# EAGLE design Switched Outlet Rev C (EAGLE 9.7.0)
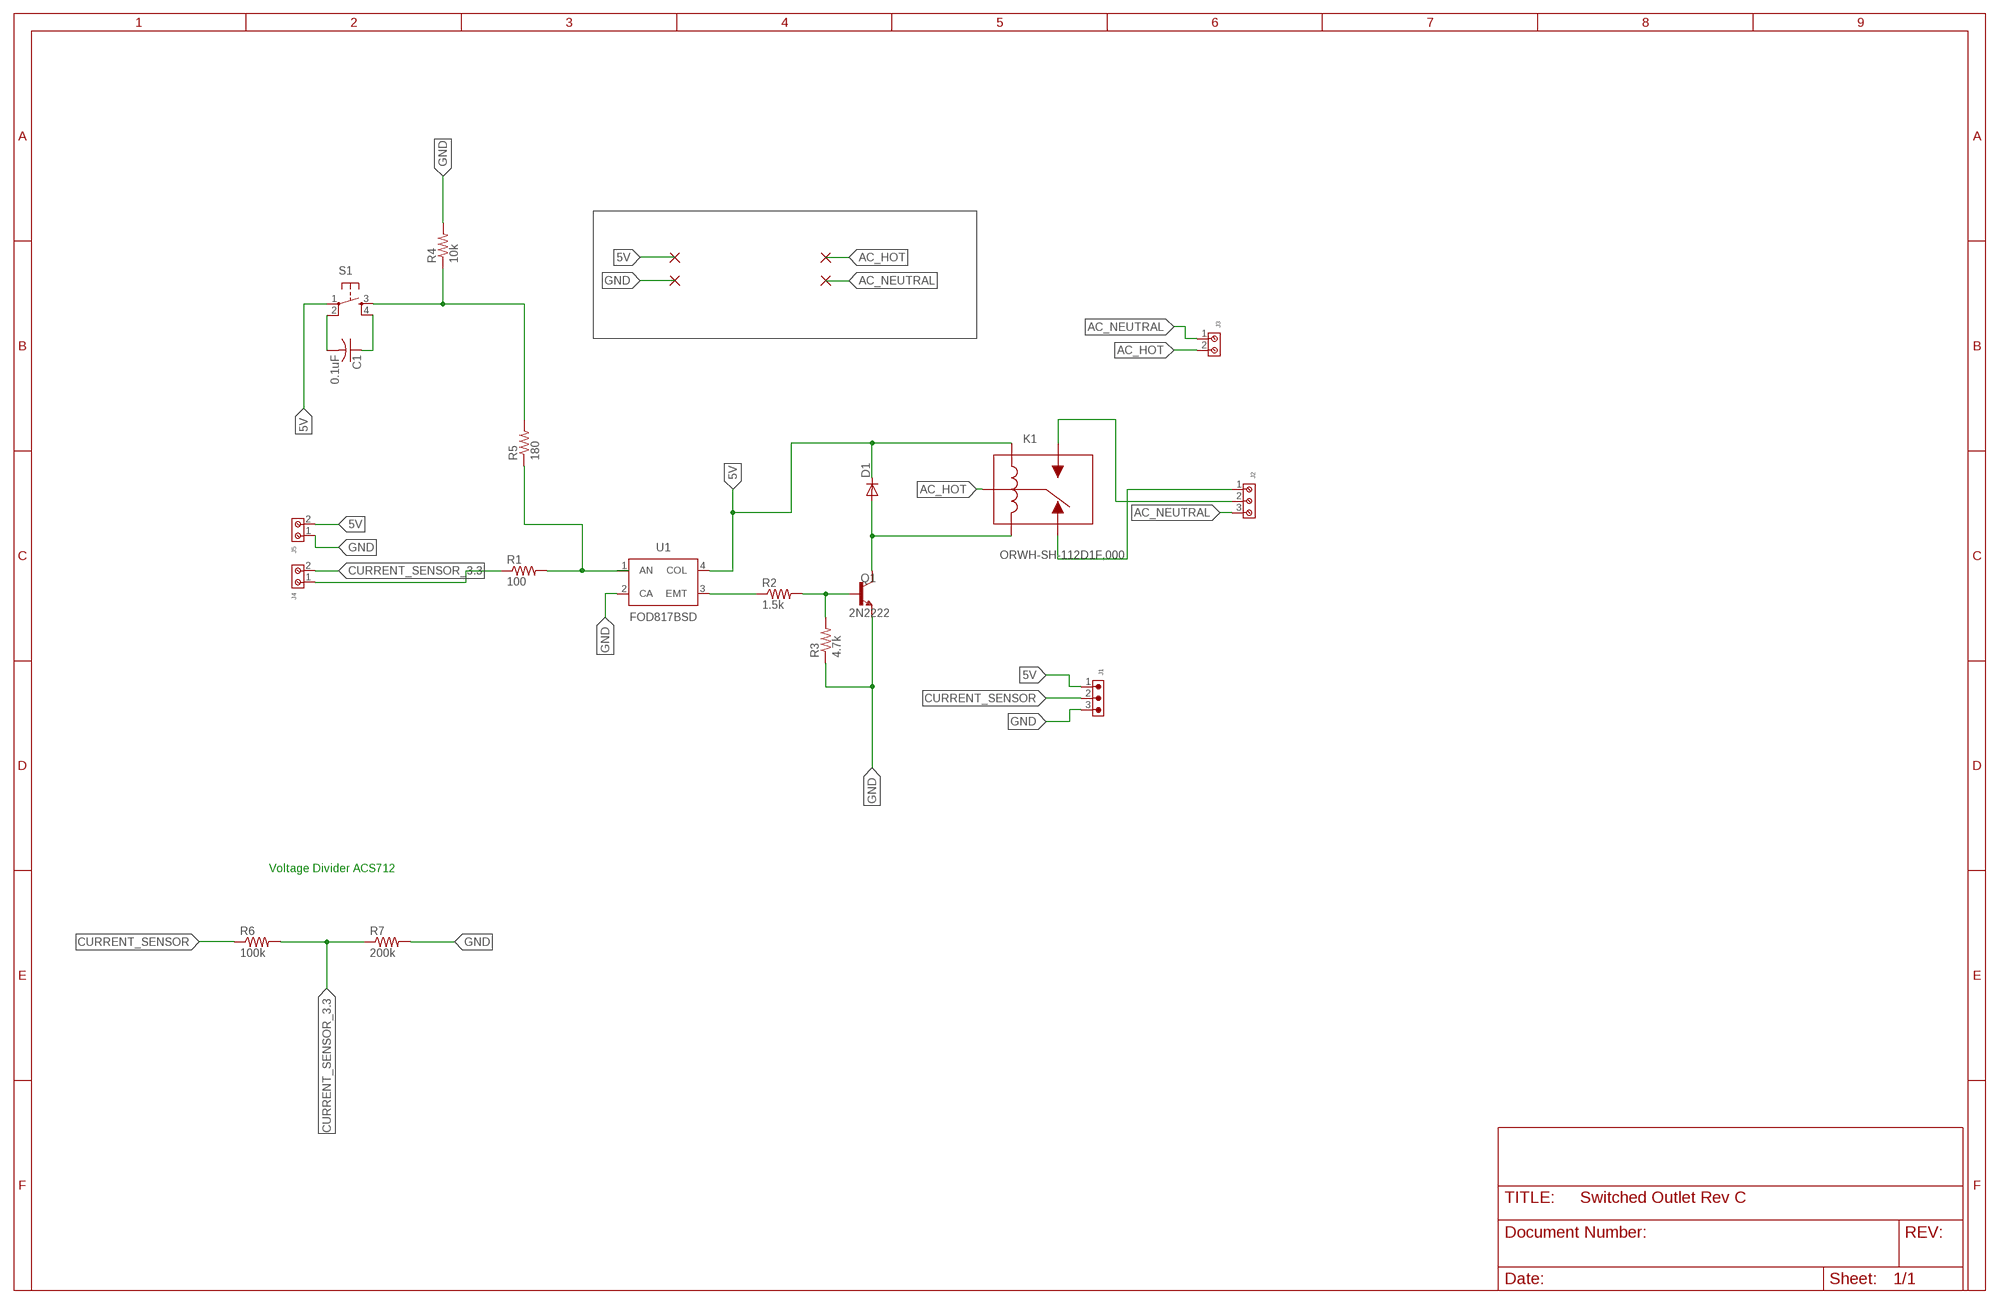
[diagram p0: schematic, sheet 1]

## Parts
C1  0.1uF  CAPACITOR-CERAMIC  [C050-024X044]
D1  1N4000  [DO41-10]
J1  6130XX11121_61300311121  [61300311121]
J2  691102710003  [691102710003]
J3  691102710002  [691102710002]
J4  691103110002  [691103110002]
J5  691103110002  [691103110002]
K1  ORWH-SH-112D1F,000  [ORWH-SH-112D1F,000]
Q1  2N2222  [TO92-EBC-OVAL]
R1  100  RESISTOR  [0207/10]
R2  1.5k  RESISTOR  [0207/10]
R3  4.7k  RESISTOR  [0207/10]
R4  10k  RESISTOR  [0207/10]
R5  180  RESISTOR  [0207/10]
R6  100k  RESISTOR  [0207/10]
R7  200k  RESISTOR  [0207/10]
S1  TACTILE-BUTTON10XX  [B3F-10XX]
U1  FOD817BSD  FOD817BSDSMT  [DIP1016W60P279L460H460Q4B]

## Nets
5V: D1.C J1.1 J5.2 K1.1 S1.1(P) U1.4(COL)
AC_HOT: J3.2 K1.2
AC_NEUTRAL: J2.3 J3.1
CURRENT_SENSOR: J1.2 R6.1
CURRENT_SENSOR_3.3: J4.2 R6.2 R7.1
GND: J1.3 J5.1 Q1.E R3.1 R4.2 R7.2 U1.2(CA)
N$1: J4.1 R1.1
N$2: R1.2 R5.1 U1.1(AN)
N$3: R2.1 U1.3(EMT)
N$4: Q1.B R2.2 R3.2
N$5: D1.A K1.3 Q1.C
N$6: J2.1 K1.4
N$7: J2.2 K1.5
N$8: R4.1 R5.2 S1.3(S)
N$9: C1.2 S1.2(P1)
N$10: C1.1 S1.4(S1)

## Notes on the sheet
- Voltage Divider ACS712

## Library data of the parts
C1 = Quantum Projects:CAPACITOR-CERAMIC
D1 = Quantum Projects:1N4000
J1 = Wurth_Connectors_WR-PHD:6130XX11121_61300311121: WR-PHD 2.54 mm THT Pin Header ARTICLE PROPERTIES: Pins:1;​ 2;​ 3;​ 4;​ 5;​ 6;​ 7;​ 8;​ 9;​ 10;​ 12;​ 13;​ 14;​ 15;​ 16;​ 18;​ 20;​ 22;​ 24;​ 25;​ 32;​ 36;​ 40 KIND PROPERTIES: Pitch：2.54 mm Quality Class:3 as per CECC 75 301-802 Rows：Single Gender：Pin Header Type：Straight MATERIAL PROPERTIES: Insulator Material :PBT Insulator Flammability Rating:UL94 V-0 Contact Material:Copper Alloy Contact Plating:Gold Contact Type:Stamped GENERAL INFORMATION Operating Temperature:-40 up to +105 °C Compliance:RoHS ELECTRICAL PROPERTIES: Rated Current:3 A IR 1:3 A Withstanding Voltage:500 V (AC) Contact Resistance:20 mΩ RISO:1000 MΩ CERTIFICATION UL Approval:E323964 PACKAGING PROPERTIES Packaging:Bag <https://katalog.we-online.com/media/images/v2/o33211v209%20Family_BTB_PHD_6130xx11121.jpg> Details see: https://katalog.we-online.com/en/em/PHD_2_54_THT_PIN_HEADER_6130XX11121 Updated by Yingchun,Shan 2019-10-16 2019 (C) Würth Elektronik; DATASHEET-URL: https://katalog.we-online.com/em/datasheet/61300311121.pdf; GENDER: Pin Header; IR: 3A; MATES: WR-PHD 2.54mm Angled Socket Header /SMT Socket Header/Socket Header; PACKAGING: Bag; PART-NUMBER: 61300311121; PINS: 3; ROWS: Single; TYPE: Straight
J2 = Wurth_Connectors_WR-TBL Wire Protector:691102710003: WR-TBL Serie 102 - 5.00 mm Horiz. Entry Modular KIND PROPERTIES Pitch 5 mm MATERIAL PROPERTIES Insulator Material PA66 Insulator Flammability Rating UL94 V-0 Insulator Color Blue Contact Material Brass Contact Plating Copper over Zinc Terminal Screw Material Steel Terminal Screw Plating Zinc Wire Guard Material Stainless Steel GENERAL INFORMATION Operating Temperature -40 up to +105 °C Compliance Lead free / RoHS ELECTRICAL PROPERTIES IR cULus 15 A IR VDE 17.5 A Working Voltage [cULus] 300 V (AC) Working Voltage [VDE] 250 V (AC) Withstanding Voltage [UL] 1600 V (AC) Withstanding Voltage [cULus] 1600 V (AC) Withstanding Voltage [VDE] 2000 V (AC) Contact Resistance [UL] 20 mΩ Contact Resistance [cULus] 20 mΩ Contact Resistance [VDE] 20 mΩ MECHANICAL PROPERTIES Wire Strip Length 5 up to 6 (mm) Screw M2.6 Solid Wire Section (AWG) 22 to 14 (AWG) Solid Wire Section (Metric) 0.326 to 2.08 (mm²) Stranded Wire Section (AWG) 22 to 14 (AWG) Stranded Wire Section (Metric) 0.326 to 2.08 (mm²) CERTIFICATION cULus Approval E315414 UL Approval E315414 VDE Approval 40022612 VDE Approval 40022612 Model number 102 PACKAGING PROPERTIES Packaging Box <https://katalog.we-online.com/media/images/v2/o33225v209%20Family_WR-TBL_69110271000x.jpg> Details see: https://katalog.we-online.com/en/em/TBL_5_00_102_6911027100XX Updated by Ella Wu 2019-11-07 2019(C) Wurth Elektronik; DATASHEET-URL: https://www.we-online.com/catalog/datasheet/691102710003.pdf; IR-UL: 15A; IR-VDE: 17.5A; MOUNT: THT; PART-NUMBER: 691102710003; PINS: 3; PITCH: 5mm; TYPE: Horizontal; WIRE: 22 to 14 (AWG) 0.326 to 2.08 (mm²); WORKING-VOLTAGE-UL: 300V(AC); WORKING-VOLTAGE-VDE: 250V(AC)
J3 = Wurth_Connectors_WR-TBL Wire Protector:691102710002: WR-TBL Serie 102 - 5.00 mm Horiz. Entry Modular KIND PROPERTIES Pitch 5 mm MATERIAL PROPERTIES Insulator Material PA66 Insulator Flammability Rating UL94 V-0 Insulator Color Blue Contact Material Brass Contact Plating Copper over Zinc Terminal Screw Material Steel Terminal Screw Plating Zinc Wire Guard Material Stainless Steel GENERAL INFORMATION Operating Temperature -40 up to +105 °C Compliance Lead free / RoHS ELECTRICAL PROPERTIES IR cULus 15 A IR VDE 17.5 A Working Voltage [cULus] 300 V (AC) Working Voltage [VDE] 250 V (AC) Withstanding Voltage [UL] 1600 V (AC) Withstanding Voltage [cULus] 1600 V (AC) Withstanding Voltage [VDE] 2000 V (AC) Contact Resistance [UL] 20 mΩ Contact Resistance [cULus] 20 mΩ Contact Resistance [VDE] 20 mΩ MECHANICAL PROPERTIES Wire Strip Length 5 up to 6 (mm) Screw M2.6 Solid Wire Section (AWG) 22 to 14 (AWG) Solid Wire Section (Metric) 0.326 to 2.08 (mm²) Stranded Wire Section (AWG) 22 to 14 (AWG) Stranded Wire Section (Metric) 0.326 to 2.08 (mm²) CERTIFICATION cULus Approval E315414 UL Approval E315414 VDE Approval 40022612 VDE Approval 40022612 Model number 102 PACKAGING PROPERTIES Packaging Box <https://katalog.we-online.com/media/images/v2/o33225v209%20Family_WR-TBL_69110271000x.jpg> Details see: https://katalog.we-online.com/en/em/TBL_5_00_102_6911027100XX Updated by Ella Wu 2019-11-07 2019(C) Wurth Elektronik; DATASHEET-URL: https://www.we-online.com/catalog/datasheet/691102710002.pdf; IR-UL: 15A; IR-VDE: 17.5A; MOUNT: THT; PART-NUMBER: 691102710002; PINS: 2; PITCH: 5mm; TYPE: Horizontal; WIRE: 22 to 14 (AWG) 0.326 to 2.08 (mm²); WORKING-VOLTAGE-UL: 300V(AC); WORKING-VOLTAGE-VDE: 250V(AC)
J4 J5 = Wurth_Connectors_WR-TBL Wire Protector:691103110002: WR-TBL Serie 1031 - 3.50 mm Horiz. Entry Modular KIND PROPERTIES Pitch 3.5 mm MATERIAL PROPERTIES Insulator Material PA66 Insulator Flammability Rating UL94 V-0 Insulator Color Blue Contact Material Brass Contact Plating Copper over Zinc Terminal Screw Material Steel Terminal Screw Plating Zinc Wire Guard Material Stainless Steel GENERAL INFORMATION Operating Temperature -40 up to +105 °C Compliance Lead free / RoHS ELECTRICAL PROPERTIES IR UL 10 A Working Voltage [UL] 125 V (AC) Withstanding Voltage [UL] 1250 V (AC) Contact Resistance 20 mΩ Contact Resistance [UL] 20 mΩ MECHANICAL PROPERTIES Wire Strip Length 5 up to 6 (mm) Screw M2 Solid Wire Section (AWG) 26 to 16 (AWG) Solid Wire Section (Metric) 0.129 to 1.31 (mm²) Stranded Wire Section (AWG) 26 to 16 (AWG) Stranded Wire Section (Metric) 0.129 to 1.31 (mm²) CERTIFICATION UL Approval E315414 PACKAGING PROPERTIES Packaging Box <https://katalog.we-online.com/media/images/v2/o33226v209%20Family_WR-TBL_69110311000x.jpg> Details see: https://katalog.we-online.com/en/em/TBL_3_50_1031_6911031100XX Updated by Ella Wu 2019-11-07 2019(C) Wurth Elektronik; DATASHEET-URL: https://www.we-online.com/catalog/datasheet/691103110002.pdf; IR-UL: 10A; MOUNT: THT; PART-NUMBER: 691103110002; PINS: 2; PITCH: 3.5mm; TYPE: Horizontal; WIRE: 26 to 16 (AWG) 0.129 to 1.31 (mm²); WORKING-VOLTAGE-UL: 125V(AC)
K1 = Relay:ORWH-SH-112D1F,000: RELAY GEN PURPOSE SPDT 10A 12V Manufacturer's datasheet <https://www.te.com/commerce/DocumentDelivery/DDEController?Action=srchrtrv&DocNm=1721150&DocType=Customer+Drawing&DocLang=English>; CREATED_BY: PCBLayout.com; DIGIKEY_PART_NUMBER: PB2029-ND; MANUFACTURER: TE Connectivity Potter & Brumfield Relays; MANUFACTURER_PART_NUMBER: ORWH-SH-112D1F,000
Q1 = Quantum Projects:2N2222
R1-R7 = Quantum Projects:RESISTOR
S1 = Quantum Projects:TACTILE-BUTTON
U1 = Opto-Electronic:FOD817BSD: 4-Pin DIP Phototransistor Optocouplers; CATEGORY: Opto-Electronic; MANUFACTURER: ON Semiconductor; MPN: FOD817BSD; OPERATING_TEMP: -55 to +110 °C; PART_STATUS: Active; ROHS_COMPLIANT: RoHS3 Compliant; SUB-CATEGORY: OptoCoupler; THERMALLOSS: 0.2W

## Board
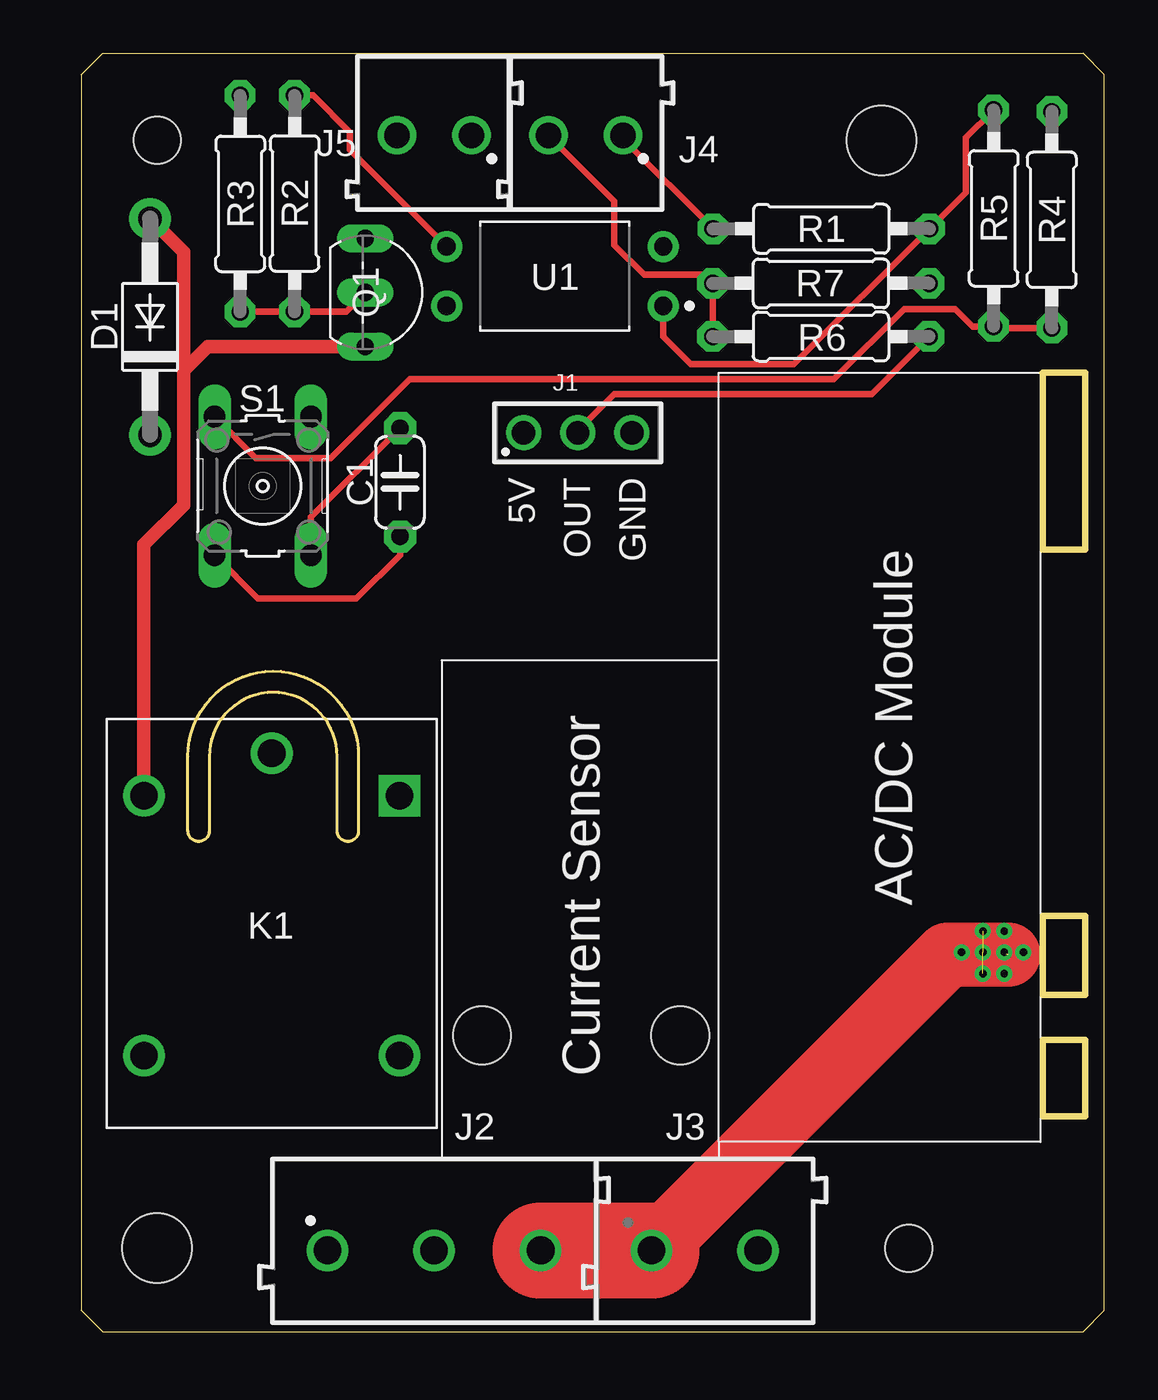
[diagram p1: board, top side]
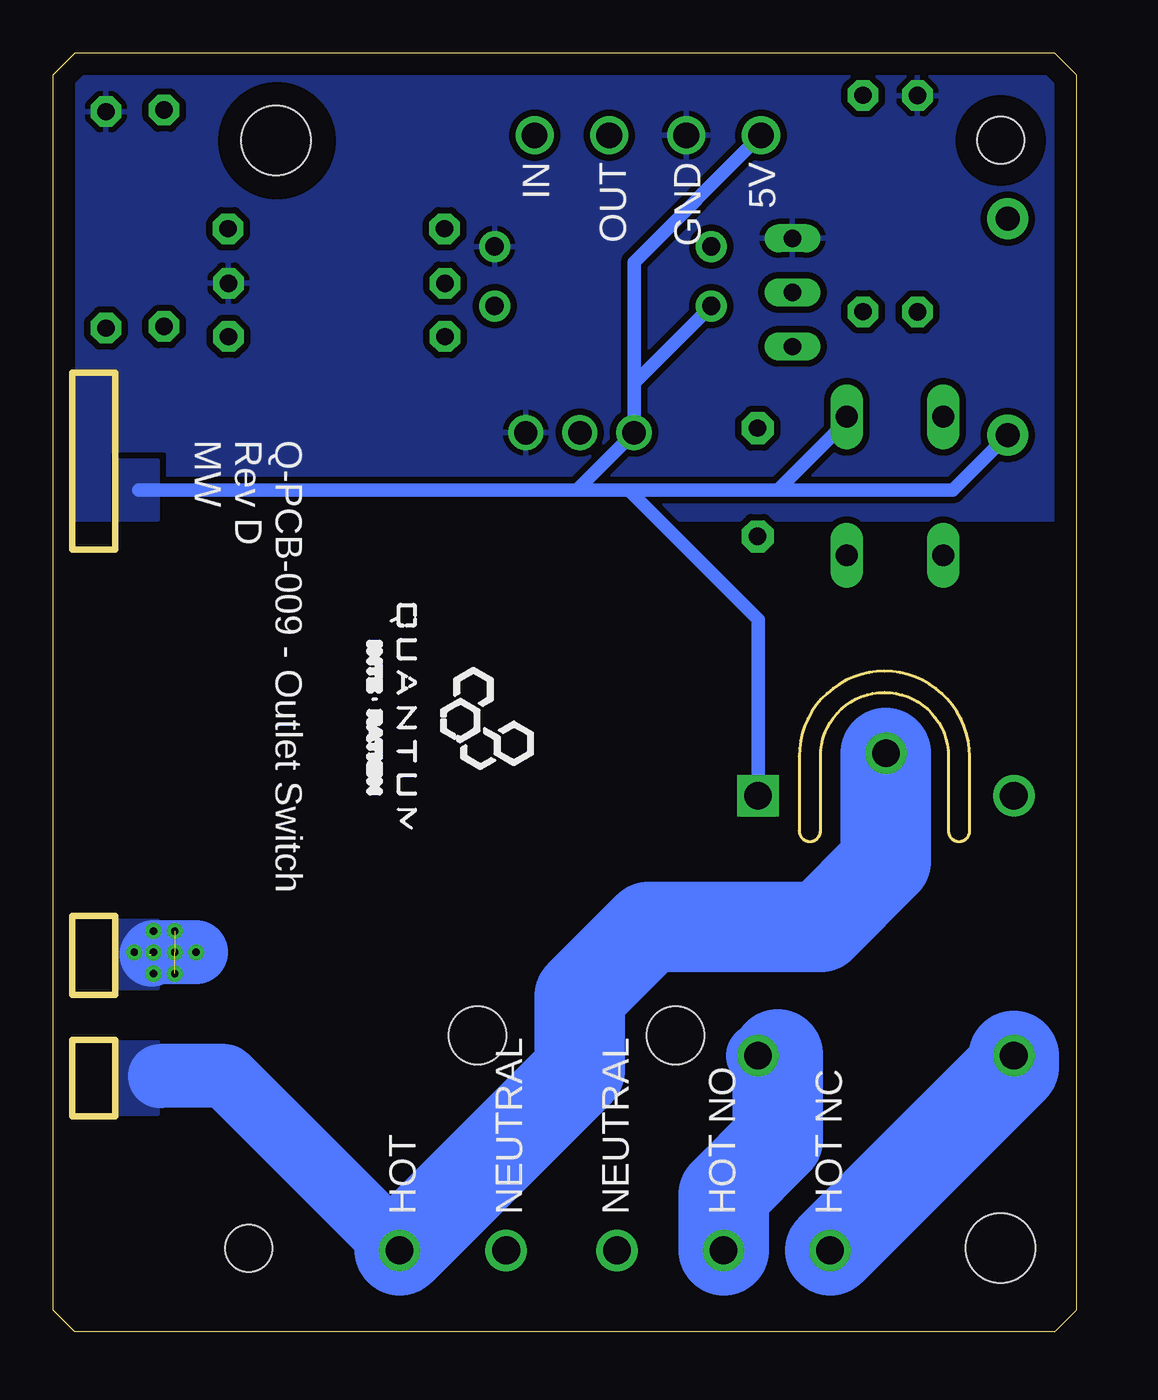
[diagram p2: board, bottom side, seen from below]

Size 48 x 60 mm. Coordinates in mm from the lower left corner, seen from the top.
Outline: 0,59 0,1 1,0 47,0 48,1 48,59 47,60 1,60 0,59
Copper layers (1*16): Top 0.035mm / dielectric 1.5mm / Bottom 0.035mm
Design rules "quantum-drc": minimum track width 12mil, minimum drill 0.35mm, track to track 12mil, track to pad 8mil, pad to pad 12mil, via to via 10mil, smd to smd 6mil, copper to edge 40mil, drill to drill 6mil, minimum pad ring 10mil, minimum via ring 8mil, stop-mask expansion 4mil, vias tented up to drill 50mil, thermal gap 10mil
Holes 2.2 mm at 3.55,55.91 38.82,3.91
Holes 3.25 mm at 37.55,55.91 3.55,3.91
Holes 2.7 mm at 28.1,13.9 18.8,13.9
tRestrict: area 16.4,11.6 to 21.2,16.2; area 25.8,11.6 to 30.5,16.2; area 36.8,1.9 to 40.8,5.9; area 1.5,53.9 to 5.5,57.9; area 34.8,53.1 to 40.2,58.6; area 34.8,53.1 to 40.2,58.6; area 0.8,1.1 to 6.2,6.7; area 0.8,1.1 to 6.2,6.7
bRestrict: area 16.4,11.6 to 21.2,16.2; area 25.8,11.6 to 30.5,16.2; area 36.8,1.9 to 40.8,5.9; area 1.5,53.9 to 5.5,57.9; area 34.8,53.1 to 40.2,58.6; area 0.8,1.1 to 6.2,6.7
Milling: 24 lines

### Footprints (pad centres in the part's own frame; a part is rotated, then mirrored left to right if it is on the bottom)
C050-024X044 = drill 0.813 pad 1.5 octagon: 1 -2.54,0; 2 2.54,0
DO41-10 = drill 1.118 pad 1.93: A 5.08,0; C -5.08,0
61300311121 = drill 1.1: 1 -2.54,0; 2 0,0; 3 2.54,0
691102710003 = drill 1.3: 1 -5,0; 2 0,0; 3 5,0
691102710002 = drill 1.3: 1 -2.5,0; 2 2.5,0
691103110002 = drill 1.2: 1 -1.75,0; 2 1.75,0
ORWH-SH-112D1F,000 = drill 1.3 square: 1 -6.1,6 | drill 1.3: 2 -8.1,0; 3 -6.1,-6; 4 6.1,-6; 5 6.1,6
TO92-EBC-OVAL = drill 0.813 long: B 0,0; C 2.54,0; E -2.54,0
0207/10 = drill 0.813 pad 1.43 octagon: 1 -5.08,0; 2 5.08,0
B3F-10XX = drill 1.016 long: 1 -3.251,2.261; 2 3.251,2.261; 3 -3.251,-2.261; 4 3.251,-2.261
DIP1016W60P279L460H460Q4B = drill 0.854 pad 1.454: 1 -5.08,1.395; 2 -5.08,-1.395; 3 5.08,-1.395; 4 5.08,1.395

### Placement (x,y rotation side)
C1  14.95,39.87 90 top
D1  3.22,47.16 90 top
J1  23.29,42.19 0 top
J2  16.55,3.81 0 top
J3  29.25,3.81 0 top
J4  23.66,56.15 180 top
J5  16.55,56.15 180 top
K1  8.93,19.05 270 top
Q1  13.32,48.77 270 top
R1  34.72,51.77 0 top
R2  10,52.95 270 top
R3  7.45,52.93 270 top
R4  45.53,52.18 90 top
R5  42.8,52.25 270 top
R6  34.7,46.7 180 top
R7  34.7,49.2 0 top
S1  8.51,39.69 270 top
U1  22.21,49.54 180 top

### Tracks (layer width: path | path; a pad name or v marks a point on that pad's centre or on a via)
5V
  Bottom 0.635: J5.2 20.75,50.2 J1.1 | J1.1 20.75,44.52 U1.4 | J1.1 23.44,39.5 | 23.44,39.5 44,39.5 | 23.44,39.5 21,39.5 | 21,39.5 14,39.5 | 14,39.5 5.8,39.5 D1.C | 14,39.5 10.77,42.73 S1.1 | K1.1 14.93,33.43 21,39.5
  pour Bottom: 43.08,38.08 44.92,38.08 44.92,40.92 43.08,40.92
AC_HOT
  Bottom 3: J3.2 39.94,12 43,12
  Bottom 4.25: J3.2 23.29,12.27 23.29,15.76 20.05,19 12,19 8.93,22.07 K1.2
  pour Bottom: 43.08,10.18 44.92,10.18 44.92,13.62 43.08,13.62
AC_NEUTRAL  (via drill 0.35)  (3 unrouted)
  Top 3: J3.1 40.64,17.7 43.5,17.7
  Top 4.5: J2.3 J3.1
  Bottom 0.305: v42.3,18.8 v43.3,18.8
  Bottom 3: v41.3,17.8 v43.3,17.8 43.4,17.7
  other vias: 43.3,16.8 42.3,17.8 42.3,16.8 44.2,17.8
  pour Bottom: 43.08,16.08 44.92,16.08 44.92,19.32 43.08,19.32
CURRENT_SENSOR
  Top 0.305: R6.1 37.08,44 25,44 23.29,42.29 J1.2
CURRENT_SENSOR_3.3
  Top 0.305: R6.2 R7.1 29.22,49.6 26.4,49.6 25,51 25,53.06 J4.2
GND
  pour Bottom: 43.08,42.08 44.92,42.08 44.92,44.92 43.08,44.92
  pour Bottom (rank 2): -2.92,38.08 49.92,38.08 49.92,60.92 -2.92,60.92
N$1
  Top 0.305: R1.1 25.41,55.99 J4.1
N$2
  Top 0.305: R5.1 41.5,56.03 41.5,53.47 R1.2 33.43,45.4 28.6,45.4 27.29,46.71 U1.1
N$3
  Top 0.305: U1.3 12.6,55.47 12.6,56.3 10.87,58.03 R2.1
N$4
  Top 0.305: Q1.B 12.42,47.87 R2.2 7.47,47.87 R3.2
N$5
  Top 0.635: D1.A 4.8,50.66 4.8,45.1 | 4.8,45.1 4.8,38.8 2.93,36.93 K1.3 | Q1.C 5.93,46.23 4.8,45.1
N$6
  Bottom 4.25: K1.4 2.93,12.43 J2.1
N$7
  Bottom 3: 14,13 14.88,13 K1.5
  Bottom 4.25: J2.2 16.55,6.45 14,9 14,13
N$8
  Top 0.305: R4.1 42.87,47.1 R5.2 41.83,47.17 41,48 38.6,48 35.3,44.7 15.4,44.7 11.7,41 8.19,41 S1.3
N$9
  Top 0.305: S1.2 10.77,38.22 C1.2
N$10
  Top 0.305: S1.4 8.29,34.4 12.9,34.4 14.95,36.45 C1.1

### Text on the board
tNames: 5V | OUT | GND | AC/DC Module | Current Sensor
bNames: 5V | GND | OUT | IN | Q-PCB-009 - Outlet Switch / Rev D / MW | HOT NC | HOT NO | NEUTRAL | NEUTRAL | HOT